# EAGLE design HelpDuinoShiled (EAGLE 7.7.0)
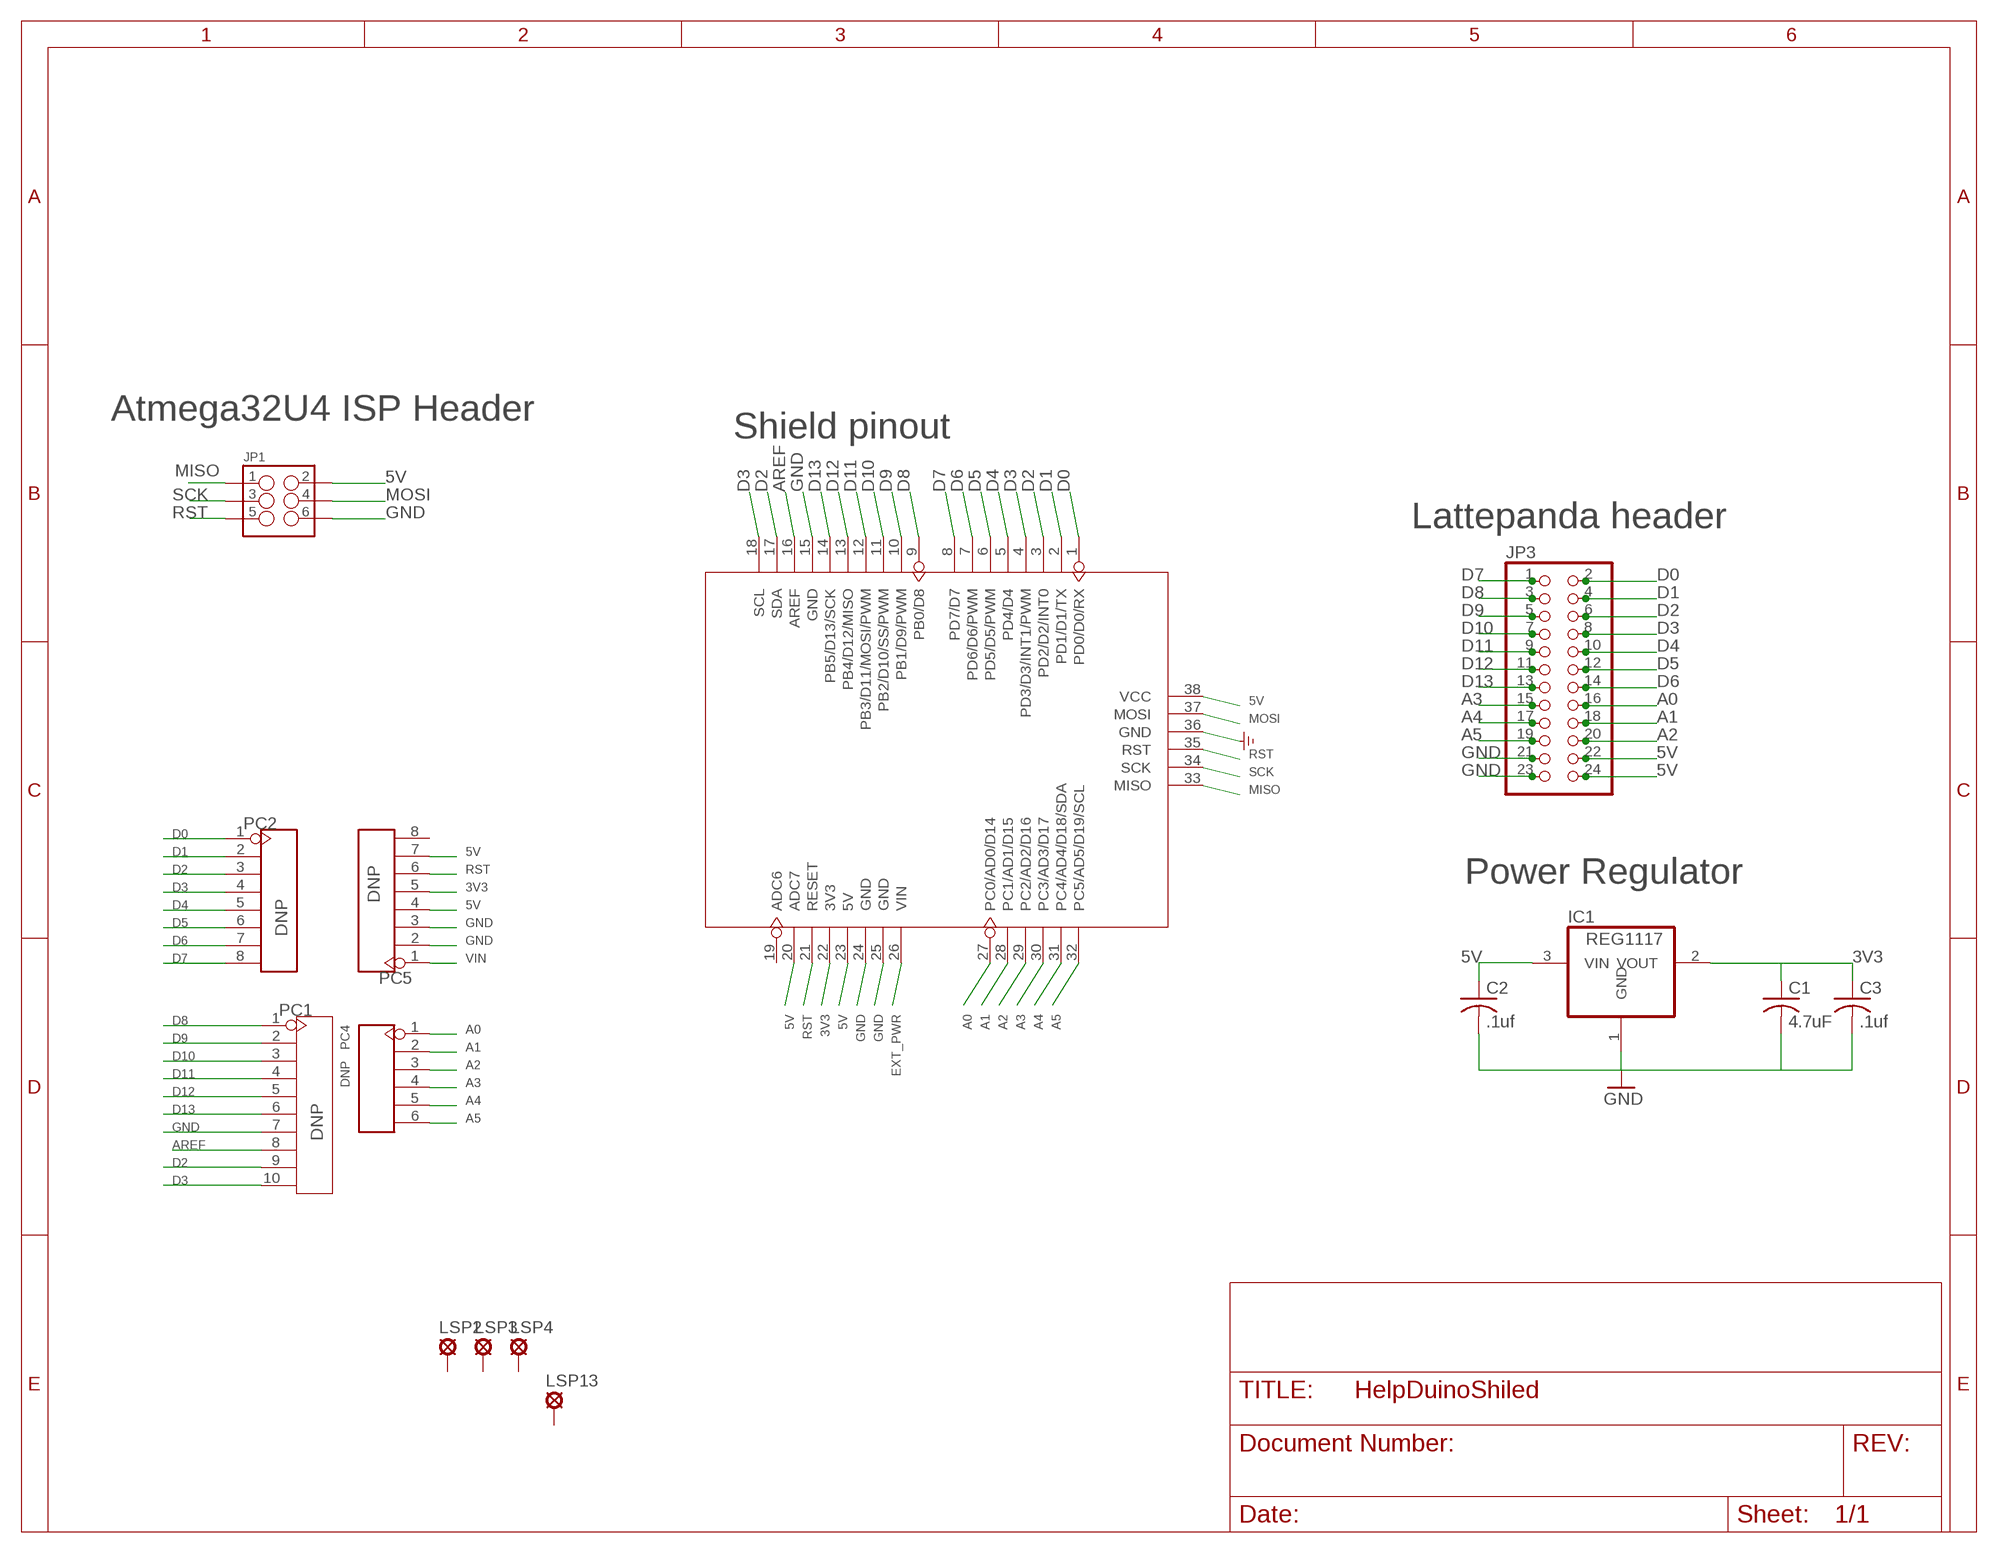
[diagram p0: schematic, sheet 1]

## Parts
C1  4.7uF  C-USC0603K  [C0603K]
C2  .1uf  C-USC0603K  [C0603K]
C3  .1uf  C-USC0603K  [C0603K]
IC1  REG1117  [SOT223]
JP1  M03X2NO_SILK  [2X3-NS]
JP3  PINHD-2X12  [2X12]
LSP2  SE13  [SE13]
LSP3  SE13  [SE13]
LSP4  SE13  [SE13]
LSP13  SE13  [SE13]
PC1  DNP  HEADER-10P-2.54  [10P-2.54]
PC2  DNP  HEADER-8P-2.54  [8P-2.54]
PC4  DNP  HEADER-6P-65/35MIL  [6P-2.54-65/35MIL]
PC5  DNP  HEADER-8P-2.54  [8P-2.54]
U1  ARDUINO-38PWITH/-SILK  [ARDUINO-38P-WITH/-SILK-500519002]

## Nets
3V3: C1.1 C3.1 IC1.2(VOUT) PC5.5 U1.22(3V3)
5V: C2.1 IC1.3(VIN) JP1.2 JP3.22 JP3.24 PC5.4 PC5.7 U1.20(ADC7) U1.23(5V) U1.38(VCC)
A0: JP3.16 PC4.1 U1.27(PC0/AD0/D14)
A1: JP3.18 PC4.2 U1.28(PC1/AD1/D15)
A2: JP3.20 PC4.3 U1.29(PC2/AD2/D16)
A3: JP3.15 PC4.4 U1.30(PC3/AD3/D17)
A4: JP3.17 PC4.5 U1.31(PC4/AD4/D18/SDA)
A5: JP3.19 PC4.6 U1.32(PC5/AD5/D19/SCL)
AREF: PC1.8 U1.16(AREF)
D0: JP3.2 PC2.1 U1.1(PD0/D0/RX)
D1: JP3.4 PC2.2 U1.2(PD1/D1/TX)
D2: JP3.6 PC1.9 PC2.3 U1.3(PD2/D2/INT0) U1.17(SDA)
D3: JP3.8 PC1.10 PC2.4 U1.4(PD3/D3/INT1/PWM) U1.18(SCL)
D4: JP3.10 PC2.5 U1.5(PD4/D4)
D5: JP3.12 PC2.6 U1.6(PD5/D5/PWM)
D6: JP3.14 PC2.7 U1.7(PD6/D6/PWM)
D7: JP3.1 PC2.8 U1.8(PD7/D7)
D8: JP3.3 PC1.1 U1.9(PB0/D8)
D9: JP3.5 PC1.2 U1.10(PB1/D9/PWM)
D10: JP3.7 PC1.3 U1.11(PB2/D10/SS/PWM)
D11: JP3.9 PC1.4 U1.12(PB3/D11/MOSI/PWM)
D12: JP3.11 PC1.5 U1.13(PB4/D12/MISO)
D13: JP3.13 PC1.6 U1.14(PB5/D13/SCK)
EXT_PWR: U1.26(VIN)
GND: C1.2 C2.2 C3.2 IC1.1(GND) JP1.6 JP3.21 JP3.23 PC1.7 PC5.2 PC5.3 U1.15(GND) U1.24(GND) U1.25(GND) U1.36(GND) ; supply symbol labelled GND_POWER
MISO: JP1.1 U1.33(MISO)
MOSI: JP1.4 U1.37(MOSI)
RST: JP1.5 PC5.6 U1.21(RESET) U1.35(RST)
SCK: JP1.3 U1.34(SCK)
VIN: PC5.1
Unconnected: LSP2.MP LSP3.MP LSP4.MP LSP13.MP PC5.8 U1.19(ADC6)

## Notes on the sheet
- Atmega32U4 ISP Header
- Shield pinout
- Lattepanda header
- Power Regulator

## Library data of the parts
C1-C3 = rcl:C-US: CAPACITOR, American symbol
IC1 = burr-brown:REG1117: 800mA and 1A Low Dropout (LDO) Positive Regulator 1.8V, 2.5V, 2.85V, 3.3V, 5V, and Adj; MPN: REG1117; OC_FARNELL: 1097566; OC_NEWARK: 14P6981
JP1 = SparkFun-Connectors:M03X2: 2x3 .1" header. Shrouded, with keying- CONN-10681 SMT- CONN-11415 Pogo pins- HW-11044
JP3 = pinhead:PINHD-2X12: PIN HEADER
LSP2-LSP4 LSP13 = solpad:SE13: SOLDER PAD E1542, drill 1,3mm, distributor Buerklin, 07F815
PC1 = Connector:HEADER-10P
PC2 PC5 = Connector:HEADER-8P
PC4 = Connector:HEADER-6P
U1 = moudle:ARDUINO-38P

## Net classes
0 default: width 0.152 mm, clearance 0.152 mm

## Board
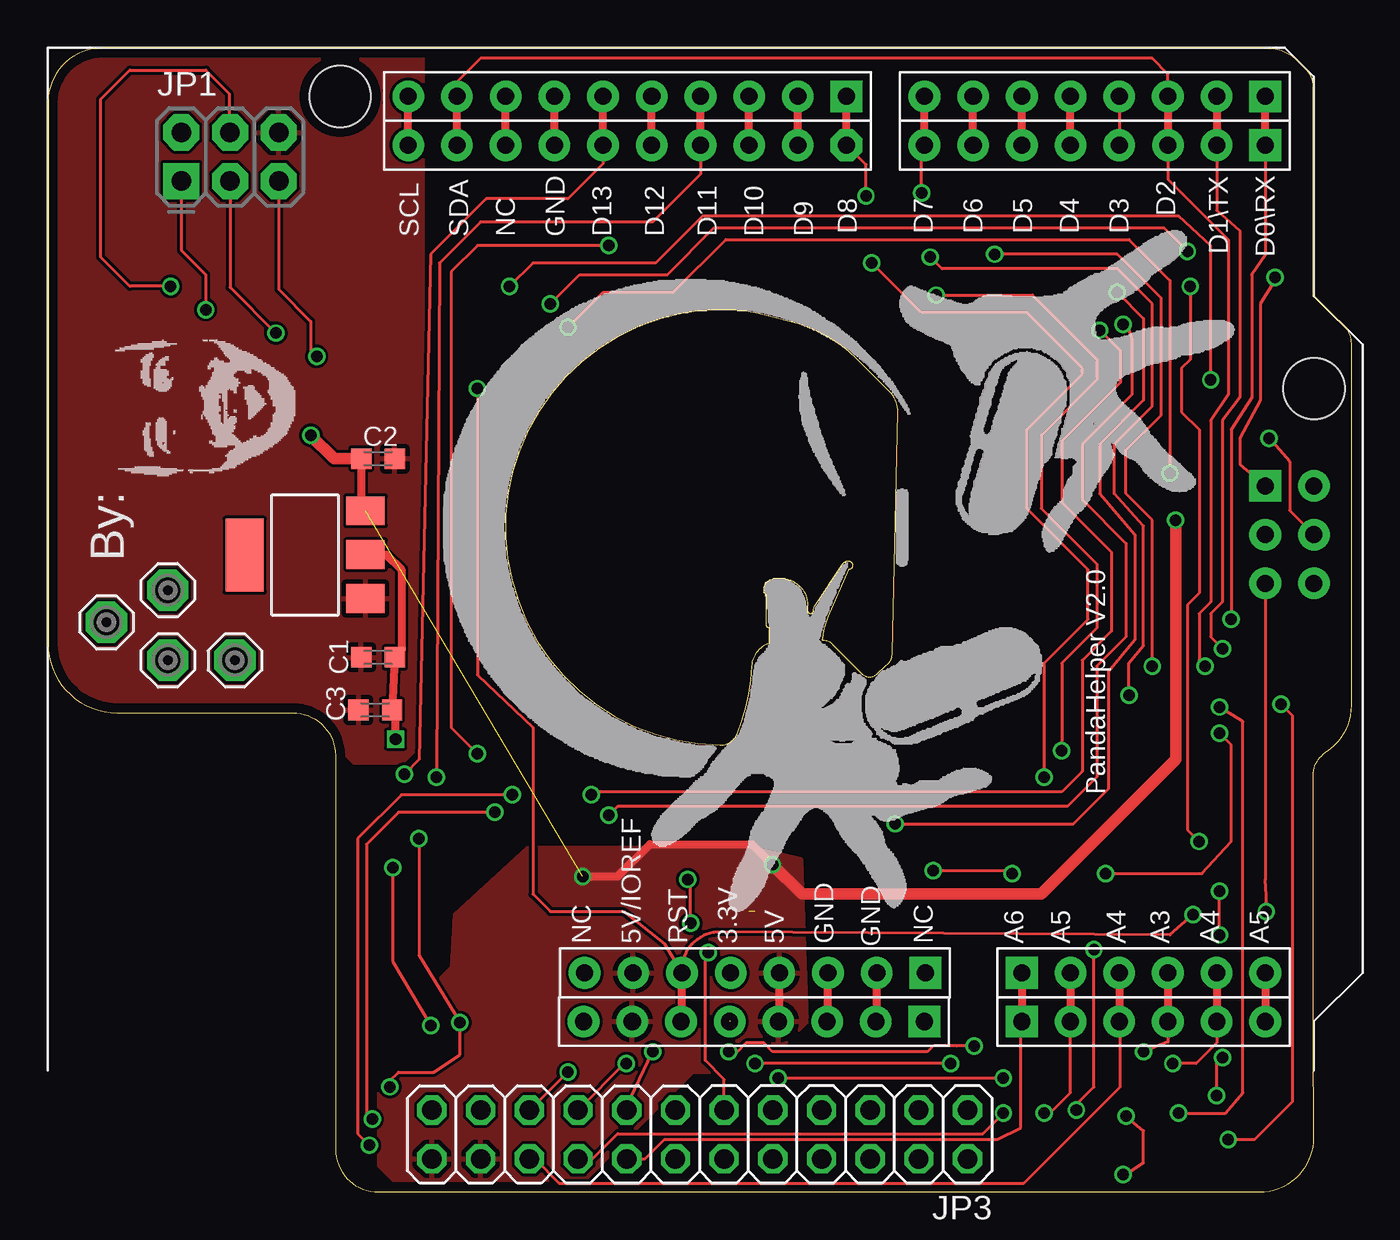
[diagram p1: board, top side]
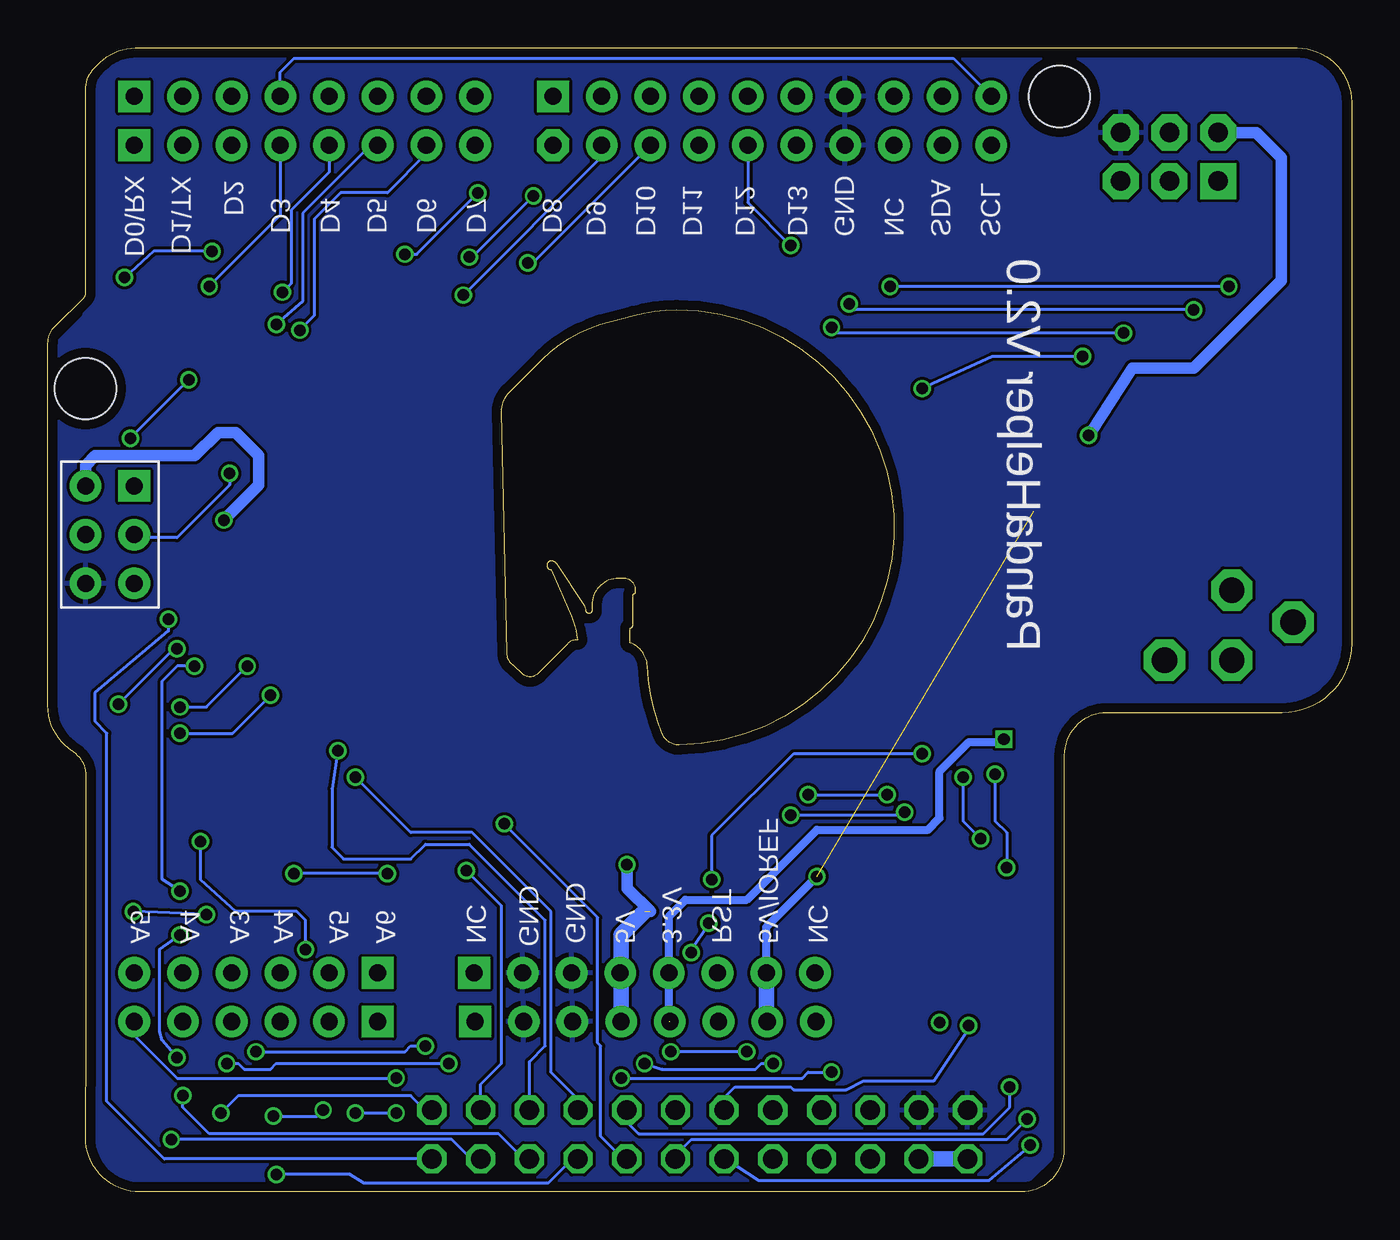
[diagram p2: board, bottom side, seen from below]

Size 68 x 59.68 mm. Coordinates in mm from the lower left corner, seen from the top.
Outline: 63.44,59.68 2.83,59.68 arc90 0,56.84 0,28.61 arc90 3.61,25 12.76,25 arc-90 15,22.76 15,2.24 arc90 17.24,0 63.18,0 arc90 66.04,2.86 66,8.15 66,21.73 arc-52 66.54,22.84 66.93,23.15 arc52 68,25.37 68,44.27 arc45 67.62,45.18 66.11,46.66 arc-45 66.04,46.84 66.04,57.49 arc45 65.56,58.64 65.28,58.92 arc45 63.44,59.68
Outline: 39.17,45.26 37.49,45.72 arc15 35.2,46.02 arc179 35.05,23.32 arc69 35.97,23.93 arc19 36.73,27.43 arc-68 37.64,28.65 37.64,29.41 arc-90 37.49,29.57 37.49,31.09 arc90 37.34,31.24 37.34,31.39 arc-90 37.95,32 38.25,32 arc-90 39.62,30.63 39.62,30.33 arc90 39.78,30.18 arc90 39.93,30.33 arc-34 40.01,30.61 41.45,32.77 arc-59 41.76,32.92 arc-174 41.76,32.46 40.69,30.02 arc19 40.39,28.8 arc-45 40.91,28.59 42.46,27.03 arc86 43.21,27.01 43.75,27.48 arc48 44.05,28.13 44.34,40.68 arc46 43.92,41.73 42.22,43.43 arc28 39.17,45.26
Copper layers (1*16): Top 0.035mm / dielectric 1.6mm / Bottom 0.035mm
Design rules "Elecrow_2-layer_PCB_eagle_rule": minimum track width 6mil, minimum drill 12mil, track to track 6mil, track to pad 6mil, pad to pad 6mil, via to via 8mil, smd to smd 0mil, copper to edge 20mil, drill to drill 10mil, minimum pad ring 6mil, minimum via ring 6mil, stop-mask expansion 0mil, vias tented up to drill 100mil, thermal gap 10mil

### Footprints (pad centres in the part's own frame; a part is rotated, then mirrored left to right if it is on the bottom)
C0603K = smd 1.05 x 1.08: 1 -0.875,0; 2 0.875,0
SOT223 = smd 1.499 x 2.007: 1 -2.261,-3.15; 2 0.025,-3.15; 3 2.311,-3.15 | smd 3.81 x 2.007: 4 0,3.15
2X3-NS = drill 1.016 pad 1.88 square: 1 -2.54,-1.27 | drill 1.016 pad 1.88 octagon: 2 -2.54,1.27; 3 0,-1.27; 4 0,1.27; 5 2.54,-1.27; 6 2.54,1.27
2X12 = drill 1.016 octagon: 1 -13.97,-1.27; 2 -13.97,1.27; 3 -11.43,-1.27; 4 -11.43,1.27; 5 -8.89,-1.27; 6 -8.89,1.27; 7 -6.35,-1.27; 8 -6.35,1.27; 9 -3.81,-1.27; 10 -3.81,1.27; 11 -1.27,-1.27; 12 -1.27,1.27; 13 1.27,-1.27; 14 1.27,1.27; 15 3.81,-1.27; 16 3.81,1.27; 17 6.35,-1.27; 18 6.35,1.27; 19 8.89,-1.27; 20 8.89,1.27; 21 11.43,-1.27; 22 11.43,1.27; 23 13.97,-1.27; 24 13.97,1.27
SE13 = drill 1.321 pad 2.159 octagon: MP 0,0
10P-2.54 = drill 0.889 pad 1.651 octagon: 1 0,11.43 | drill 0.889 pad 1.651: 2 0,8.89; 3 0,6.35; 4 0,3.81; 5 0,1.27; 6 0,-1.27; 7 0,-3.81; 8 0,-6.35; 9 0,-8.89; 10 0,-11.43
8P-2.54 = drill 0.889 pad 1.651 square: 1 0,8.89 | drill 0.889 pad 1.651: 2 0,6.35; 3 0,3.81; 4 0,1.27; 5 0,-1.27; 6 0,-3.81; 7 0,-6.35; 8 0,-8.89
6P-2.54-65/35MIL = drill 0.889 pad 1.651 square: 1 0,6.35 | drill 0.889 pad 1.651: 2 0,3.81; 3 0,1.27; 4 0,-1.27; 5 0,-3.81; 6 0,-6.35
ARDUINO-38P-WITH/-SILK-500519002 = drill 0.889 pad 1.651 square: 1 63.5,50.8; 9 41.656,50.8; 26 45.72,2.54; 27 50.8,2.54; 33 63.5,30.48 | drill 0.889 pad 1.651: 2 60.96,50.8; 3 58.42,50.8; 4 55.88,50.8; 5 53.34,50.8; 6 50.8,50.8; 7 48.26,50.8; 8 45.72,50.8; 10 39.116,50.8; 11 36.576,50.8; 12 34.036,50.8; 13 31.496,50.8; 14 28.956,50.8; 15 26.416,50.8; 16 23.876,50.8; 17 21.336,50.8; 18 18.796,50.8; 19 27.94,2.54; 20 30.48,2.54; 21 33.02,2.54; 22 35.56,2.54; 23 38.1,2.54; 24 40.64,2.54; 25 43.18,2.54; 28 53.34,2.54; 29 55.88,2.54; 30 58.42,2.54; 31 60.96,2.54; 32 63.5,2.54; 34 63.5,27.94; 35 63.5,25.4; 36 66.04,25.4; 37 66.04,27.94; 38 66.04,30.48 | hole 3.2: 15.24,50.8; 66.04,35.56

### Placement (x,y rotation side)
C1  17.22,27.89 180 top
C2  17.22,38.25 0 top
C3  17.07,25.15 180 top
IC1  13.41,33.22 90 top
JP1  9.5,54 0 top
JP3  34,3 180 top
LSP2  6.25,31.39 0 top
LSP3  3.05,29.72 0 top
LSP4  9.75,27.74 0 top
LSP13  6.25,27.74 0 top
PC1  30.23,54.61 270 top
PC2  54.61,54.61 270 top
PC4  57.15,11.43 90 top
PC5  36.88,11.43 270 top
U1  0,6.35 0 top
U$1  [OBSIDISLOGO]  61.87,14.63 90 top
U$2  [FACELOGO]  0.15,36.88 0 top

### Tracks (layer width: path | path; a pad name or v marks a point on that pad's centre or on a via)
3V3  (via drill 0.6)  (1 unrouted)
  Top 0.406: IC1.2 17.65,33.25 18.44,32.46 18.44,28.23 C1.1 C3.1 18.14,24.95 v18.14,23.62
  Bottom 0.406: 35.61,8.89 PC5.5 35.61,14.38 34.75,15.24 31.55,15.24 27.89,18.9 22.1,18.9 21.49,19.51 21.49,21.95 19.96,23.47 18.29,23.47 v18.14,23.62
5V  (via drill 0.6)  (2 unrouted)
  Top 0.406: U1.23 38.15,8.89 PC5.4 | C2.1 16.35,35.75 IC1.3 | v27.89,16.46 29.72,16.46 31.39,18.14 36.73,18.14 v37.8,17.07
  Top 0.61: v58.83,35.05 58.83,22.55 51.82,15.54 39.32,15.54 v37.8,17.07 | C2.1 14.94,38.25 v13.72,39.47
  Bottom 0.406: PC5.7 30.53,13.82 v27.89,16.46
  Bottom 0.61: U1.38 66.04,37.9 65.53,38.41 60.35,38.41 59.13,39.62 58.22,39.62 57,38.41 57,36.88 v58.83,35.05 | v37.8,17.07 37.8,15.85 36.58,14.63 | JP1.2 4.98,55.27 3.66,53.95 3.66,47.55 8.23,42.98 11.43,42.98 v13.72,39.47
  Bottom 0.813: U1.23 38.1,13.41 36.88,14.63 | JP3.22 JP3.24 | 30.48,11.48 PC5.7 30.53,8.59 30.48,8.53
  pour Top: 18.14,0.46 27.89,0.46 33.68,6.25 37.03,6.25 39.62,8.84 39.32,17.37 36.73,17.98 24.99,17.98 21.18,14.48 21.03,11.73 17.22,7.92 17.22,1.37
A0
  Top 0.152: JP3.16 31.14,1.73 32.16,2.74 49.53,2.74 50.75,3.35 50.75,8.84 U1.27
  Top 0.406: PC4.1 U1.27
A1  (via drill 0.6)
  Top 0.152: JP3.18 28.4,1.73 29.72,3.05 48.77,3.05 v49.84,4.12 | v51.97,4.12 52.27,4.12 53.34,5.18 U1.28
  Top 0.406: PC4.2 U1.28
  Bottom 0.152: v49.84,4.12 v51.97,4.12
A2
  Top 0.152: JP3.20 25.4,1.73 26.67,0.46 50.9,0.46 55.93,5.49 55.93,8.84 U1.29
  Top 0.406: PC4.3 U1.29
A3  (via drill 0.6)
  Top 0.152: U1.30 58.42,7.82 v57.15,7.32 | v48.31,7.62 47.4,7.62 46.18,7.62 45.87,7.32 37.8,7.32 37.34,7.77 36.42,7.77 35.97,7.32 v35.52,7.32 | JP3.15 30.19,4.43 v31.55,7.32
  Top 0.406: PC4.4 U1.30
  Bottom 0.152: v57.15,7.32 49.38,7.32 49.07,7.62 v48.31,7.62 | v31.55,7.32 v35.52,7.32
A4  (via drill 0.6)
  Top 0.152: U1.31 60.96,7.77 59.89,6.71 v58.67,6.71 | v47.09,6.71 v36.88,6.71 | v30.18,6.71 30.09,6.71 JP3.17
  Top 0.406: PC4.5 U1.31
  Bottom 0.152: v58.67,6.71 58.06,6.71 57.76,6.4 56.39,6.4 56.08,6.71 v47.09,6.71 | v36.88,6.71 35.97,6.4 31.09,6.4 30.79,6.71 v30.18,6.71
A5  (via drill 0.6)
  Top 0.152: v49.84,5.94 v38.1,5.94 | v27.13,6.25 26.78,5.94 JP3.19
  Top 0.406: PC4.6 U1.32
  Bottom 0.152: v49.84,5.94 61.27,5.94 63.5,8.18 U1.32 | v38.1,5.94 28.65,5.94 28.35,6.25 v27.13,6.25
AREF
  Top 0.406: PC1.8 U1.16
D0  (via drill 0.6)
  Top 0.152: PC2.1 63.5,48.87 62.79,47.85 62.79,41.45 61.72,39.78 v61.72,29.87
  Top 0.406: PC2.1 U1.1
  Bottom 0.152: JP3.2 61.93,1.73 64.92,4.72 64.92,23.93 65.53,24.54 65.53,26.06 61.72,29.26 v61.72,29.87
D1  (via drill 0.6)
  Top 0.152: v61.57,2.74 62.94,2.74 64.92,4.72 64.92,24.84 v64.31,25.45 | PC2.2 60.96,51.2 62.18,50.14 62.18,41.45 61.27,40.23 61.27,30.79 60.66,30.18 60.66,28.96 v61.27,28.35
  Top 0.406: U1.2 PC2.2
  Bottom 0.152: JP3.4 45.93,1.73 46.94,2.74 v61.57,2.74 | v64.31,25.45 61.42,28.35 v61.27,28.35
D2  (via drill 0.6)
  Top 0.152: U1.3 58.42,58.32 57.61,59.13 22.55,59.13 21.34,57.91 U1.17 | PC2.3 58.42,52.83 61.57,49.68 61.57,41.6 60.66,40.23 60.66,30.79 60.05,30.18 60.05,27.74 v60.35,27.43 | v61.27,7.01 60.96,6.71 v60.96,5.03 | v61.11,13.41 v61.11,15.7
  Top 0.406: PC1.9 U1.17 | U1.3 PC2.3
  Bottom 0.152: JP3.6 43.18,1.73 44.5,3.05 59.59,3.05 60.96,4.42 v60.96,5.03 | v61.27,7.01 62.03,7.92 62.18,8.38 62.18,12.65 v61.11,13.41 | v60.35,27.43 61.27,27.43 62.03,26.67 62.03,16.31 v61.11,15.7
D3  (via drill 0.6)
  Top 0.152: U1.4 PC2.4 | v56.08,0.91 56.24,0.91 57.15,1.52 57.15,3.2 v56.24,3.96 | v53.65,4.27 53.65,4.57 54.56,5.49 v54.56,12.65 | v59.59,47.24 59.59,43.43 59.13,42.98 59.13,40.69 60.05,39.78 60.05,31.24 59.44,30.63 59.44,18.9 v60.05,18.29
  Top 0.406: PC1.10 U1.18 | U1.4
  Bottom 0.152: U1.4 55.88,58.42 55.17,59.13 20.78,59.13 U1.18 | JP3.8 40.64,1.73 41.91,0.46 51.51,0.46 52.27,0.91 v56.08,0.91 | v56.24,3.96 53.95,3.96 v53.65,4.27 | v54.56,12.65 54.56,14.17 55.02,14.63 58.22,14.63 60.05,16.31 v60.05,18.29 | PC2.4 55.88,50.95 v59.59,47.24
D4  (via drill 0.6)
  Top 0.152: v55.78,46.94 57.15,45.57 57.15,41.3 54.86,39.01 54.86,36.42 56.69,34.29 56.69,28.8 55.32,27.13 55.32,21.03 53.49,19.2 v44.2,19.2
  Top 0.406: PC2.5 U1.5
  Bottom 0.152: JP3.10 38,1.73 39.17,2.9 39.17,7.62 39.32,7.77 39.32,14.33 v44.2,19.2 | PC2.5 53.34,53.19 55.32,51.21 55.32,47.4 v55.78,46.94
D5  (via drill 0.6)
  Top 0.152: v56.08,45.26 56.39,44.96 56.54,44.5 56.54,41.6 53.95,39.01 53.95,36.12 56.24,33.83 56.24,28.96 54.71,27.43 54.71,21.64 53.19,20.12 29.72,20.12 v29.26,19.66 | v23.32,19.81 18.29,19.81 16.61,18.14 16.61,4.12 v16.92,3.81
  Top 0.406: PC2.6 U1.6
  Bottom 0.152: JP3.12 35.27,1.92 34.44,2.74 17.98,2.74 v16.92,3.81 | PC2.6 51.16,54.61 54.71,51.05 54.71,46.48 v56.08,45.26 | v29.26,19.66 23.47,19.66 v23.32,19.81
D6  (via drill 0.6)
  Top 0.152: v54.86,44.96 55.93,43.89 55.93,42.22 52.88,39.17 52.88,35.97 55.47,33.38 55.47,29.26 53.95,27.74 53.95,21.95 52.88,20.88 28.5,20.88 v28.35,20.73 | v24.23,20.73 18.44,20.73 16.15,18.44 16.15,3.05 v16.76,2.44
  Top 0.406: PC2.7 U1.7
  Bottom 0.152: JP3.14 32.67,1.73 30.94,0.61 18.9,0.61 16.92,2.29 v16.76,2.44 | PC2.7 48.26,54.15 50.29,52.12 52.73,52.12 54.1,50.75 54.1,45.72 v54.86,44.96 | v28.35,20.73 v24.23,20.73
D7  (via drill 0.6)
  Top 0.152: v58.98,4.12 61.42,4.12 62.33,5.18 62.33,24.54 v61.11,25.3 | v57.61,27.43 57.61,35.05 56.24,36.42 56.24,38.71 58.06,40.54 58.06,46.63 55.78,48.92 v49.38,48.92 | v45.57,52.12 45.57,54.45 PC2.8
  Top 0.406: PC2.8 U1.8
  Bottom 0.152: JP3.1 48.31,4.27 49.07,5.03 58.06,5.03 v58.98,4.12 | v61.11,25.3 59.74,25.3 v57.61,27.43 | v49.38,48.92 48.77,48.92 v45.57,52.12
D8  (via drill 0.6)
  Top 0.152: v46.18,16.76 49.84,16.76 v50.29,16.61 | v55.17,16.61 60.2,16.61 61.72,18.29 61.72,23.32 v61.11,23.93 | v56.39,25.91 56.39,27.58 57.15,28.5 57.15,34.75 55.63,36.42 55.63,39.01 57.61,41 57.61,46.33 55.78,48.16 46.63,48.16 v46.02,48.77 | v42.67,51.97 42.67,53.59 PC1.1
  Top 0.406: PC1.1 U1.9
  Bottom 0.152: JP3.3 45.43,5.62 44.35,6.71 44.35,14.94 v46.18,16.76 | v61.11,23.93 58.37,23.93 v56.39,25.91 | v46.02,48.77 45.87,48.77 v42.67,51.97 | v50.29,16.61 v55.17,16.61
D9  (via drill 0.6)
  Top 0.152: v46.33,46.79 51.36,46.79 54.71,43.43 54.71,42.37 51.82,39.47 51.82,35.66 54.71,32.77 54.71,29.41 52.88,27.58 v52.88,23.01
  Top 0.406: PC1.2 U1.10
  Bottom 0.152: JP3.5 42.89,6.79 42.06,7.62 42.06,14.17 46.02,18.14 48.31,18.14 49.07,17.37 52.58,17.37 53.19,17.98 53.19,21.03 v52.88,23.01 | PC1.2 39.12,54 v46.33,46.79
D10  (via drill 0.6)
  Top 0.152: v51.97,21.64 51.97,27.58 54.25,29.87 54.25,32.46 51.05,35.66 51.05,39.78 53.95,42.67 53.95,42.98 51.05,45.87 45.57,45.87 v42.98,48.46
  Top 0.406: PC1.3 U1.11
  Bottom 0.152: JP3.7 40.35,4.84 41.76,6.25 41.76,14.63 45.87,18.75 49.07,18.75 v51.97,21.64 | v42.98,48.46 42.72,48.46 PC1.3
D11  (via drill 0.6)
  Top 0.152: PC1.4 34.03,53.09 31.55,50.6 22.55,50.6 20.42,48.46 20.27,21.95 v20.27,21.64 | v17.83,5.49 17.83,5.79 18.29,6.25 20.12,6.25 21.49,7.16 v21.49,8.84 19.36,12.34 19.36,17.98 v19.36,18.44
  Top 0.406: PC1.4 U1.12
  Bottom 0.152: JP3.9 37.81,3.67 37.19,3.05 19.2,3.05 17.83,4.42 v17.83,5.49 | v20.27,21.64 20.27,19.36 v19.36,18.44
D12  (via drill 0.6)
  Top 0.152: JP3.11 35.27,5.88 34.29,6.86 34.29,12.34 v34.44,12.5 | v33.53,14.02 33.53,16 33.38,16.15 v33.38,16.31 | v29.26,49.38 22.4,49.38 21.03,48.01 21.03,24.23 v22.4,22.86
  Top 0.406: PC1.5 U1.13
  Bottom 0.152: v34.44,12.5 34.44,12.65 v33.53,14.02 | PC1.5 31.5,51.61 v29.26,49.38 | v22.4,22.86 29.11,22.86 33.38,18.59 v33.38,16.31
D13  (via drill 0.6)
  Top 0.152: PC1.6 28.95,53.64 27.13,51.82 22.86,51.82 19.96,48.92 19.36,22.55 v18.59,21.79 | v19.96,8.69 17.98,12.04 v17.98,16.92
  Top 0.406: PC1.6 U1.14
  Bottom 0.152: JP3.13 32.73,4.91 32.16,5.49 29.26,5.49 29.11,5.33 26.36,5.33 25.45,5.79 21.79,5.79 19.96,8.53 v19.96,8.69 | v18.59,21.79 18.59,19.36 17.98,18.75 v17.98,16.92
GND
  Top 0.406: U1.25 43.23,8.89 PC5.2 | U1.24 40.69,8.89 PC5.3 | PC1.7 U1.15
  pour Bottom: 1.83,59.74 64.31,59.74 66.14,57.91 66.14,46.33 66.14,45.72 67.97,43.89 67.97,23.77 65.53,21.34 65.53,1.52 64.01,0 17.37,0 14.94,2.44 14.94,23.47 13.41,24.99 2.44,24.99 -0.3,27.74 -0.3,57.61
  pour Top: 19.51,59.28 19.51,23.47 18.44,22.4 16,22.4 15.09,23.32 15.09,23.93 13.87,25.15 2.59,25.15 0,27.74 0,57.61 2.13,59.74 19.05,59.74
MISO  (via drill 0.6)
  Top 0.152: JP1.1 6.96,49.12 8.23,47.85 v8.23,46.02 | v26.21,46.33 27.74,47.85 32.31,47.85 34.75,50.29 58.22,50.29 v59.44,49.07 | v64.01,47.7 64.01,47.55 63.25,46.33 63.25,41.3 62.18,39.32 62.18,37.95 U1.33
  Bottom 0.152: v8.23,46.02 25.91,46.02 v26.21,46.33 | v59.44,49.07 62.48,49.07 v64.01,47.7
MOSI  (via drill 0.6)
  Top 0.152: v60.66,42.37 60.66,49.38 58.98,50.9 34.14,50.9 31.7,48.46 25.3,48.46 v24.08,47.24 | v6.4,47.24 4.27,47.24 2.74,48.77 2.74,57 4.27,58.52 8.23,58.52 9.45,57.3 9.45,55.32 JP1.4 | v63.7,39.32 64.77,38.1 64.77,35.56 U1.37
  Bottom 0.152: v24.08,47.24 v6.4,47.24 | v63.7,39.32 v60.66,42.37
RST  (via drill 0.6)
  Top 0.152: U1.35 63.5,16.31 63.55,15.44 v63.55,14.63 | JP1.5 12.04,47.09 13.72,45.41 13.72,43.89 v14.02,43.59 | v22.4,41.91 22.4,26.98 25.3,24.23 25.3,15.54 26.21,14.63 30.02,14.63 32.16,12.95 PC5.6 arc-90 34.9,13.56 58.52,13.41 v59.74,14.48
  Top 0.406: U1.21 33.07,8.89 PC5.6
  Bottom 0.152: v14.02,43.59 18.75,43.59 v22.4,41.91 | v59.74,14.48 v63.55,14.63
SCK  (via drill 0.6)
  Top 0.152: JP1.3 9.5,47.19 v11.89,44.81 | v27.13,45.11 28.96,46.94 32.61,46.94 35.36,49.68 56.39,49.68 58.52,47.55 v58.52,37.49
  Bottom 0.152: v11.89,44.81 26.82,44.81 v27.13,45.11 | v58.52,37.49 58.52,36.88 61.27,34.14 63.35,34.14 U1.34

### Text on the board
tPlace: By: | PandaHelper V2.0
bPlace: PandaHelper V2.0
tNames: D2 | SCL | SDA | NC | GND | D13 | D12 | D11 | D10 | D9 | D8 | D7 | D6 | D5 | D4 | D3 | D1\\TX | D0\\RX | NC | 5V/IOREF | RST | 3.3V | 5V | GND | GND | NC | A6 | A5 | A4 | A3 | A4 | A5
bNames: D2 | SCL | SDA | NC | GND | D13 | D12 | D11 | D10 | D9 | D8 | D7 | D6 | D5 | D4 | D3 | D1\\TX | D0\\RX | NC | 5V/IOREF | RST | 3.3V | 5V | GND | GND | NC | A6 | A5 | A4 | A3 | A4 | A5